# Altium project Carte_Alim.PrjPcb (part 1 of 2)
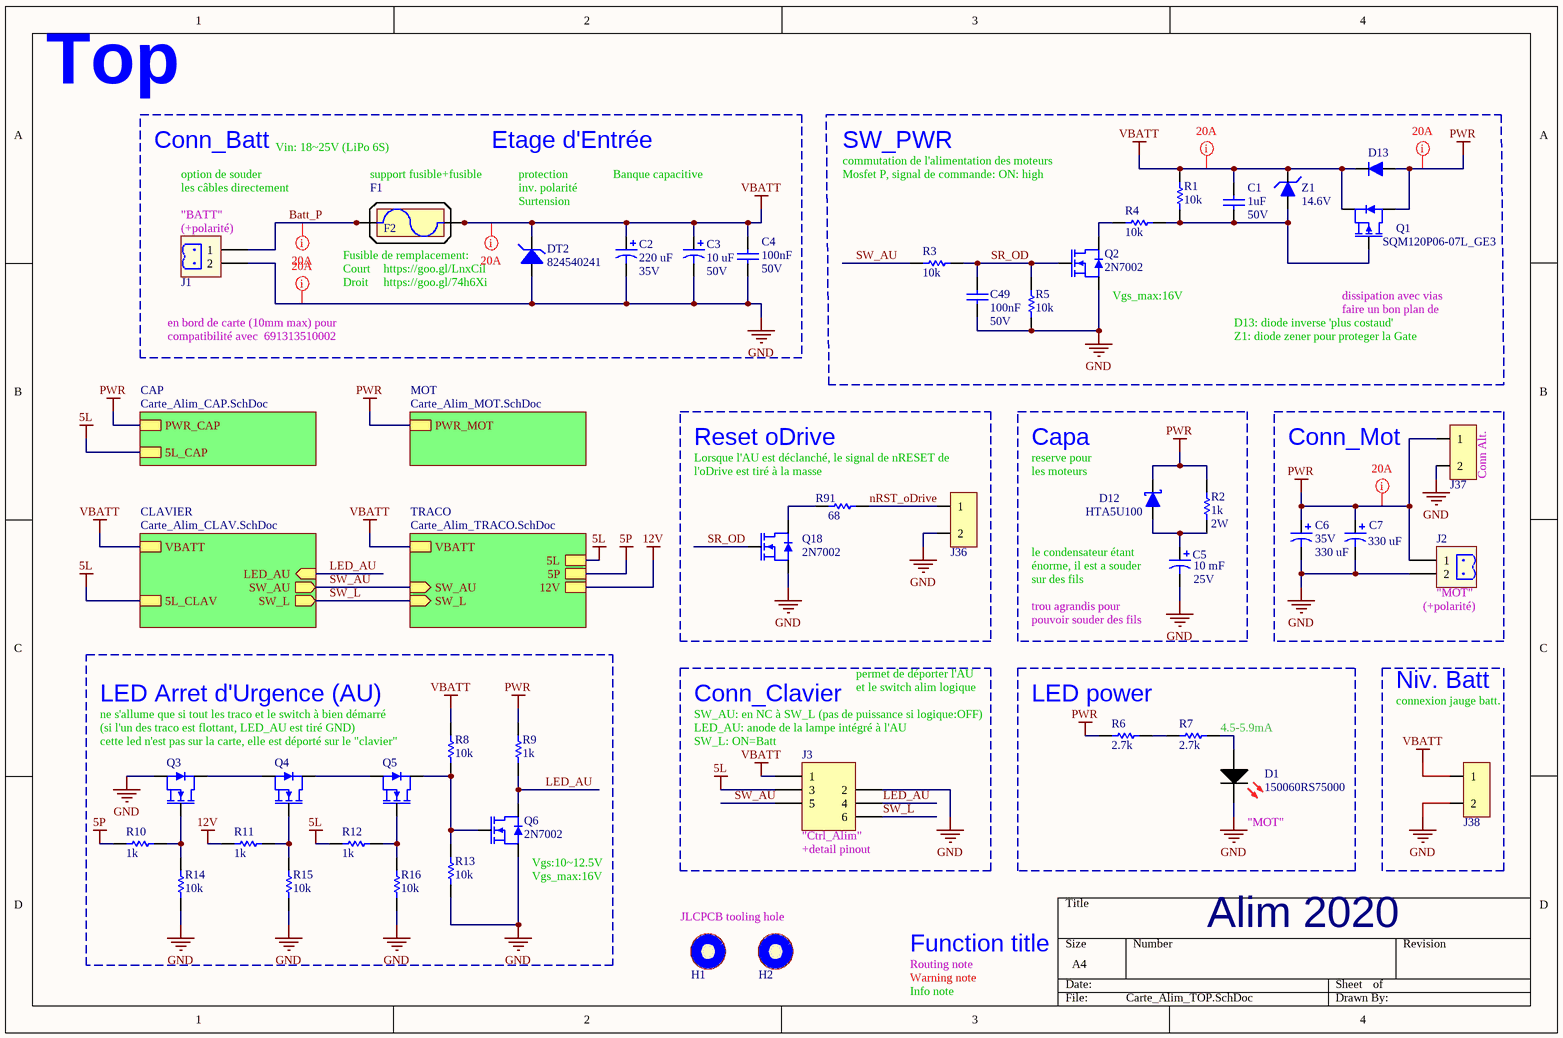
[diagram p0: Carte_Alim_TOP.SchDoc]
5 sheets, 240 parts. Net scope: hierarchical (ports join the sheet entries above them; power ports are global).
Board file: Carte_Alim-4L.PcbDoc
Sheets:
  Carte_Alim_TOP.SchDoc
    CAP = Carte_Alim_CAP.SchDoc
    TRACO = Carte_Alim_TRACO.SchDoc
    MOT = Carte_Alim_MOT.SchDoc
    CLAVIER = Carte_Alim_CLAV.SchDoc

## Sheet Carte_Alim_TOP.SchDoc
size A4; Author: Audran; CompanyName: Goldorak; Address1: Electrolab; Address2: 52 rue Paul Lescop; Address3: 92000 Nanterre; DocumentNumber: 1; SheetNumber: 1; SheetTotal: 5; ProjectName: Cartes_2017

### Parts
C1  1uF  RatedVoltage: 50V  [WCAP-CSGP_0805, 2x1.25x1.25]
C2  220 uF  RatedVoltage: 35V  [WCAP-ATG8_8x11.5x3.5x0.5]
C3  10 uF  RatedVoltage: 50V  [WCAP-ATG8_5x11x2x0.5]
C4  100nF  RatedVoltage: 50V  [WCAP-CSGP_0603, 1.6x0.8x0.8]
C5  10 mF  RatedVoltage: 25V  [WCAP-ATG8_22x41x10x0.8]
C6  330 uF  RatedVoltage: 35V  [WCAP-ATG8_10x12.5x5x0.6]
C7  330 uF  [WCAP-ATG8_10x12.5x5x0.6]
C49  100nF  RatedVoltage: 50V  [WCAP-CSGP_0603, 1.6x0.8x0.8]
D1  150060RS75000  [SMCW_0603]
D12  HTA5U100  [SMA, DO-214AC]
D13  RS3J R6  [SMC, DO-214AB]  (value not drawn)
DT2  824540241  [SMC, DO-214AB]
F1  3557-2  [3557-2]  (value not drawn)
F2  0891030.NXS  (value not drawn)  (mechanical)
H1  1.152mm  [Tooling_hole_JLCPCB]  (value not drawn)  (no BOM)
H2  1.152mm  [Tooling_hole_JLCPCB]  (value not drawn)  (no BOM)
J1  691311500102  [691311500102]  (value not drawn)
J2  691311500102  [691311500102]  (value not drawn)
J3  690367280676  [690367280676]  (value not drawn)
J36  22-03-2021  [22-03-2021]  (value not drawn)
J37  22-03-2021  [22-03-2021]  (value not drawn)
J38  22-03-2021  [22-03-2021]  (value not drawn)
Q1  SQM120P06-07L_GE3  [TO263AB, D2PAK]
Q2  2N7002  [SOT-23]
Q3  2N7002  [SOT-23]  (value not drawn)
Q4  2N7002  [SOT-23]  (value not drawn)
Q5  2N7002  [SOT-23]  (value not drawn)
Q6  2N7002  [SOT-23]
Q18  2N7002  [SOT-23]
R1  value 10k  [RESC1608X06N]  (hidden comment: RC0603FR-0710KL)
R2  1k  Power: 2W  [RESADV480W80L1200D390]
R3  value 10k  [RESC1608X06N]  (hidden comment: RC0603FR-0710KL)
R4  value 10k  [RESC1608X06N]  (hidden comment: RC0603FR-0710KL)
R5  value 10k  [RESC1608X06N]  (hidden comment: RC0603FR-0710KL)
R6  value 2.7k  [RESC2012X06N]  (hidden comment: RC0805FR-072K7L)
R7  value 2.7k  [RESC2012X06N]  (hidden comment: RC0805FR-072K7L)
R8  value 10k  [RESC1608X06N]  (hidden comment: RC0603FR-0710KL)
R9  value 1k  [RESC1608X06N]  (hidden comment: RC0603FR-071KL)
R10  value 1k  [RESC1608X06N]  (hidden comment: RC0603FR-071KL)
R11  value 1k  [RESC1608X06N]  (hidden comment: RC0603FR-071KL)
R12  value 1k  [RESC1608X06N]  (hidden comment: RC0603FR-071KL)
R13  value 10k  [RESC1608X06N]  (hidden comment: RC0603FR-0710KL)
R14  value 10k  [RESC1608X06N]  (hidden comment: RC0603FR-0710KL)
R15  value 10k  [RESC1608X06N]  (hidden comment: RC0603FR-0710KL)
R16  value 10k  [RESC1608X06N]  (hidden comment: RC0603FR-0710KL)
R91  value 68  [RESC1608X06N]  (hidden comment: RC0603FR-0768RL)
Z1  value 14.6V  [SOD-323]  (hidden comment: MM3Z15VST1G)

### Blocks framed on the sheet
SW_PWR: C1 C49 D13 Q1 Q2 R1 R3-R5 Z1
Reset oDrive: J36 Q18 R91
Capa: C5 D12 R2
Conn_Mot: C6 C7 J2 J37
LED Arret d'Urgence (AU): Q3-Q6 R8-R16
Conn_Clavier: J3
LED power: D1 R6 R7
Niv. Batt: J38

### Sub-sheets
CAP = Carte_Alim_CAP.SchDoc: PWR_CAP, 5L_CAP
CLAVIER = Carte_Alim_CLAV.SchDoc: 5L_CLAV, VBATT, SW_L (out), LED_AU (in), SW_AU (out)
MOT = Carte_Alim_MOT.SchDoc: PWR_MOT
TRACO = Carte_Alim_TRACO.SchDoc: VBATT, 5L, 5P, 12V, SW_L (in), SW_AU (in)

### Nets
5L: J3.3 R12.2 ; sheet CAP/5L_CAP, sheet TRACO/5L, sheet CLAVIER/5L_CLAV
5P: R10.2 ; sheet TRACO/5P
12V: R11.2 ; sheet TRACO/12V
GND: C2.2 C3.2 C4.1 C5.2 C6.2 C7.2 C49.1 D1.1(C) DT2.1 J1.2 J2.2 J3.2 J36.2 J37.2 J38.2 Q2.2(S) Q3.2(S) Q6.2(S) Q18.2(S) R5.2 R13.1 R14.1 R15.1 R16.1
PWR: C6.1 C7.1 D12.2 D13.1 J2.1 J37.1 Q1.4(D) R2.1 R6.1 R9.2 ; sheet CAP/PWR_CAP, sheet MOT/PWR_MOT
VBATT: C1.2 C2.1 C3.1 C4.2 D13.2 DT2.2 F1.2 F1.4 J3.1 J38.1 Q1.3(S) R1.2 R8.2 Z1.2 ; sheet TRACO/VBATT, sheet CLAVIER/VBATT
Batt_P: F1.1 F1.3 J1.1
LED_AU: J3.4 Q6.3(D) R9.1 ; sheet CLAVIER/LED_AU
nRST_oDrive: J36.1 R91.2
SR_OD: C49.2 Q2.1(G) Q18.1(G) R3.2 R5.1
SW_AU: J3.5 R3.1 ; sheet TRACO/SW_AU, sheet CLAVIER/SW_AU
SW_L: J3.6 ; sheet TRACO/SW_L, sheet CLAVIER/SW_L
NetC1_1: C1.1 Q1.1(G) R1.1 R4.1 Z1.1
NetC5_1: C5.1 D12.1 R2.2
NetD1_2: D1.2(A) R7.1
NetQ2_3: Q2.3(D) R4.2
NetQ3_1: Q3.1(G) R10.1 R14.2
NetQ3_3: Q3.3(D) Q4.2(S)
NetQ4_1: Q4.1(G) R11.1 R15.2
NetQ4_3: Q4.3(D) Q5.2(S)
NetQ5_1: Q5.1(G) R12.1 R16.2
NetQ5_3: Q5.3(D) Q6.1(G) R8.1 R13.2
NetQ18_3: Q18.3(D) R91.1
NetR6_2: R6.2 R7.2

### Layout directives
net class PWR_20A: Batt_P, GND, PWR, VBATT

### Notes on the sheet
- Top
- Conn_Batt
- option de souder
- Vin: 18~25V (LiPo 6S)
- support fusible+fusible
- Etage d'Entrée
- protection
- Banque capacitive
- commutation de l'alimentation des moteurs
- Mosfet P, signal de commande: ON: high
- les câbles directement
- (near J1) "BATT"
- (near J1) (+polarité)
- inv. polarité
- Surtension
- Droit
- Court
- Fusible de remplacement:
- (near DT2) https://goo.gl/74h6Xi
- (near DT2) https://goo.gl/LnxCil
- (near Q2) Vgs_max:16V
- faire un bon plan de
- dissipation avec vias
- compatibilité avec  691313510002
- en bord de carte (10mm max) pour
- D13: diode inverse 'plus costaud'
- Z1: diode zener pour proteger la Gate
- Lorsque l'AU est déclanché, le signal de nRESET de
- (near R91) l'oDrive est tiré à la masse
- reserve pour
- les moteurs
- (near J37) Conn Alt.
- (near C5) le condensateur étant
- (near C5) énorme, il est a souder
- sur des fils
- (near C5) trou agrandis pour
- (near C5) pouvoir souder des fils
- (near J2) (+polarité)
- (near J2) "MOT"
- (near R8) ne s'allume que si tout les traco et le switch à bien démarré
- SW_AU: en NC à SW_L (pas de puissance si logique:OFF)
- permet de déporter l'AU
- et le switch alim logique
- connexion jauge batt.
- (si l'un des traco est flottant, LED_AU est tiré GND)
- (near R8) cette led n'est pas sur la carte, elle est déporté sur le "clavier"
- (near J3) LED_AU: anode de la lampe intégré à l'AU
- (near J3) SW_L: ON=Batt
- (near R7) 4.5-5.9mA
- (near J3) "Ctrl_Alim"
- (near J3) +detail pinout
- (near D1) "MOT"
- (near Q6) Vgs_max:16V
- (near Q6) Vgs:10~12.5V
- JLCPCB tooling hole
- Routing note
- Warning note
- Function title
- Alim 2020
- Info note

### Library data of the parts
C1 = WCAP-CSGP, 885012207103: CAP CER 1uF 50V X7R 0805; Manufacturer: Wurth Elektronik; ComponentLink1Description: Datasheet; ComponentLink1URL: http://katalog.we-online.com/pbs/datasheet/885012207103.pdf; Manufacturer Part Number: 885012207103; Value: 1uF; Size: 0805; CeramicType: X7R; Supplier 2: JLCPCB; Supplier Part Number 2: C28323; Supplier Footprint 2: 0805
C2 = WCAP-ATG8, 860010574011: CAP Alu 220 UF 20% 35 V; Manufacturer: Wurth Elektronik; ComponentLink1Description: Datasheet; ComponentLink1URL: http://katalog.we-online.de/pbs/datasheet/860010574011.pdf; Manufacturer Part Number: 860010574011; Value: 220 uF; Size: 8mmx11.5mm
C3 = WCAP-ATG8, 860010672009: CAP Alu 10 UF 20% 50 V; Manufacturer: Wurth Elektronik; ComponentLink1Description: Datasheet; ComponentLink1URL: http://katalog.we-online.de/pbs/datasheet/860010672009.pdf; Value: 10 uF; Size: 5mmx11mm; Manufacturer Part Number: 860010672009
C4 C49 = WCAP-CSGP, 885012206095: CAP CER 100nF 50V X7R 0603; Manufacturer: Wurth Elektronik; ComponentLink1Description: Datasheet; ComponentLink1URL: http://katalog.we-online.com/pbs/datasheet/885012206095.pdf; Value: 100nF; Size: 0603; CeramicType: X7R; Manufacturer Part Number: 885012206095; Supplier 2: JLCPCB; Supplier Part Number 2: C14663; Supplier Footprint 2: 0603
C5 = WCAP-ATG8, 860010483029: CAP Alu 10'000 UF 25 V; Manufacturer: Wurth Elektronik; ComponentLink1Description: Datasheet; ComponentLink1URL: http://katalog.we-online.de/pbs/datasheet/860010483029.pdf; Manufacturer Part Number: 860010483029; Size: 22x41mm; Value: 10 mF
C6 = WCAP-ATG8, 860010575012: CAP Alu 330 UF 20% 35 V; Manufacturer: Wurth Elektronik; ComponentLink1Description: Datasheet; ComponentLink1URL: http://katalog.we-online.de/pbs/datasheet/860010575012.pdf; Manufacturer Part Number: 860010575012; Value: 330 uF; Size: 10mmx12.5mm
C7 = WCAP-ATG8, 860010575012: CAP Alu 330 UF 20% 35 V; Manufacturer: Wurth Elektronik; RatedVoltage: 35V; ComponentLink1Description: Datasheet; ComponentLink1URL: http://katalog.we-online.de/pbs/datasheet/860010575012.pdf; Manufacturer Part Number: 860010575012; Value: 330 uF; Size: 10mmx12.5mm
D1 = WL-SMCW 0603  150060RS75000: SMD mono-color Chip LED, WL-SMCW, Red; Manufacturer: Wurth Elektronik; Value: Rouge; Manufacturer Part Number: 150060RS75000; ComponentLink1Description: Datasheet; ComponentLink1URL: http://katalog.we-online.com/led/datasheet/150060RS75000.pdf; Supplier 1: Farnell; Supplier Part Number 1: 2322071; Supplier 2: JLCPCB; Supplier Part Number 2: C2286; Supplier Footprint 2: LED_0603
D12 = HTA5U100: DIODE SCHOTTKY 100V 5A SMA (DO-214AC); Manufacturer: MULTICOMP; ContinuousForwardCurrent: 5A (Pk 50A); Supplier 1: Farnell; Manufacturer Part Number: HTA5U100; ComponentLink1URL: http://www.farnell.com/datasheets/2282884.pdf; ComponentLink1Description: Datasheet; Supplier Part Number 1: 2750942; Type: Schottky; Value: 100V
D13 = RS3J_R6: DIODE GEN PURP 600V 3A SMC; Manufacturer: TAIWAN SEMICONDUCTOR; Type: Standard; Manufacturer Part Number: RS3J R6; ContinuousForwardCurrent: 3A; Supplier 1: Farnell; Supplier Part Number 1: 2677388; ComponentLink1Description: Datasheet; ComponentLink1URL: http://www.farnell.com/datasheets/2182655.pdf; Value: 600V
DT2 = 824540241: WE-TVSP Power TVS Diode, Unidirectional, 1500 W, 24 VDC; Manufacturer: Wurth Electronics Inc.; Value: 24V; Supplier 1: Farnell; Supplier Part Number 1: 2536699; Manufacturer Part Number: 824540241; ComponentLink1URL: https://www.we-online.com/catalog/datasheet/824540241.pdf; ComponentLink1Description: Datasheet; Type: TVS
F1 = 3557-2: FUSE Holder 500V 30A PCB; Manufacturer: Keystone Electronics; Value: na; Supplier 1: Farnell; Supplier Part Number 1: 2292904; Manufacturer Part Number: 3557-2; ComponentLink1URL: http://www.keyelco.com/product-pdf.cfm?p=296; ComponentLink1Description: Datasheet
F2 = 0891030.NXS: FUSE AUTO 30A 58VDC BLADE MINI; Manufacturer: Littelfuse Inc.; Manufacturer Part Number: 0891030.NXS; Supplier 1: Digi-Key; Supplier Part Number 1: F4993-ND; ComponentLink1URL: http://www.littelfuse.com/~/media/automotive/datasheets/fuses/passenger-car-and-commercial-vehicle/blade-fuses/littelfuse_lowprofilemini_datasheet.pdf; ComponentLink1Description: Datasheet; Value: 30A
H1 H2 = HOLE_TOOLING: Tooling hole pour JLCPCB assembly; ComponentLink1Description: Manufacturer; ComponentLink1URL: https://support.jlcpcb.com/article/92-how-to-add-tooling-holes-for-smt-assembly-order
J1 J2 = 691311500102: WR-TBL 2p Series 311 - 5.08 mm Closed Vertical PCB Header; Manufacturer: Wurth Electronics Inc.; Value: 2; Manufacturer Part Number: 691311500102; ComponentLink1Description: Datasheet; ComponentLink1URL: https://katalog.we-online.de/em/datasheet/6913115001xx.pdf; Supplier 1: Farnell; Supplier Part Number 1: 1641978
J3 = 690367280676: WR-MM 6p Female SMT Connector with Polarization; Manufacturer: Wurth Electronics Inc.; Value: 6; ComponentLink1Description: Datasheet; ComponentLink1URL: http://katalog.we-online.de/em/datasheet/69036728xx76.pdf; Manufacturer Part Number: 690367280676; Supplier 1: Farnell; Supplier Part Number 1: 1641849
J36-J38 = 22-03-2021: CONN HEADER VERT 2POS 2.54MM; Manufacturer: MOLEX; Supplier 1: Farnell; Supplier Part Number 1: 9731075; Manufacturer Part Number: 22-03-2021; ComponentLink1URL: http://www.farnell.com/datasheets/1791308.pdf; ComponentLink1Description: Datasheet; ComponentLink2URL: http://www.farnell.com/cad/495071.pdf  http://www.farnell.com/cad/1533907.pdf  http://www.farnell.com/cad/1533907.pdf; ComponentLink2Description: Drawings
Q1 = SQM120P06-07L_GE3: MOSFET P 60V 120A D2PAK; Manufacturer: VISHAY; Supplier 1: Farnell; Supplier Part Number 1: 2617099; Manufacturer Part Number: SQM120P06-07L_GE3; ComponentLink1Description: Datasheet; ComponentLink1URL: http://www.vishay.com/docs/67026/sqm120p0.pdf
Q2-Q6 Q18 = 2N7002: MOSFET N 60V 115MA SOT23; Manufacturer: Changjiang Electronics Tech (CJ); Supplier 1: Farnell; Supplier Part Number 1: 1510761; Manufacturer Part Number: 2N7002; ComponentLink1Description: Datasheet; ComponentLink1URL: https://datasheet.lcsc.com/szlcsc/1810151612_Changjiang-Electronics-Tech-CJ-2N7002_C8545.pdf; Supplier 2: JLCPCB; Supplier Part Number 2: C8545; Supplier Footprint 2: SOT-23-3
R1 R3-R5 R8 R13-R16 = RC0603FR-0710KL: RES SMD 10K OHM 1% 1/10W 0603; Manufacturer: Yageo; Power: 100mW; Vmax: 50V; Manufacturer Part Number: RC0603FR-0710KL; Type: Thick Film; ComponentLink1Description: Manufacturer; ComponentLink1URL: http://www.yageo.com/NewPortal/_en/index.jsp; ComponentLink2Description: Datasheet; ComponentLink2URL: http://www.farnell.com/datasheets/2167052.pdf; Supplier 1: Farnell; Supplier Part Number 1: 9238603; Precision: ±1%; Supplier 2: JLCPCB; Supplier Part Number 2: C25804; Supplier Footprint 2: 0603
R2 = Generic_TH_Vert_Res: resistance traversante verticale générique; Manufacturer: MULTICOMP; Manufacturer Part Number: MCKNP02WJ0102A19; Precision: ±5%; Type: Through Hole; Supplier 1: Farnell; Supplier Part Number 1: 1903754; Value: 1k
R6 R7 = RC0805FR-072K7L: RES SMD 2K7 OHM 1% 1/8W 0805; Manufacturer: Yageo; Power: 125mW; Vmax: 50V; Manufacturer Part Number: RC0805FR-072K7L; Type: Thick Film; ComponentLink1Description: Manufacturer; ComponentLink1URL: http://www.yageo.com/NewPortal/_en/index.jsp; ComponentLink2Description: Datasheet; ComponentLink2URL: http://www.farnell.com/datasheets/444164.pdf; Supplier 1: Farnell; Supplier Part Number 1: 9237666; Precision: ±1%; Supplier 2: JLCPCB; Supplier Part Number 2: C17530; Supplier Footprint 2: 0805
R9-R12 = RC0603FR-071KL: RES SMD 1K OHM 1% 1/10W 0603; Manufacturer: Yageo; Power: 100mW; Vmax: 50V; Manufacturer Part Number: RC0603FR-071KL; Type: Thick Film; ComponentLink1Description: Manufacturer; ComponentLink1URL: http://www.yageo.com/NewPortal/_en/index.jsp; ComponentLink2Description: Datasheet; ComponentLink2URL: http://www.farnell.com/datasheets/2167052.pdf; Precision: ±1%; Supplier 1: Farnell; Supplier Part Number 1: 9238484; Supplier 2: JLCPCB; Supplier Part Number 2: C21190; Supplier Footprint 2: 0603
R91 = RC0603FR-0768RL: RES SMD 68 OHM 1% 1/10W 0603; Manufacturer: Yageo; Power: 100mW; Vmax: 50V; Manufacturer Part Number: RC0603FR-0768RL; Type: Thick Film; ComponentLink1Description: Manufacturer; ComponentLink1URL: http://www.yageo.com/NewPortal/_en/index.jsp; ComponentLink2Description: Datasheet; ComponentLink2URL: http://www.farnell.com/datasheets/1868787.pdf; Supplier 1: Farnell; Supplier Part Number 1: 9238344; Precision: ±1%; Supplier 2: JLCPCB; Supplier Part Number 2: C27592; Supplier Footprint 2: 0603
Z1 = MM3Z15VST1G: DIODE ZENER 14.6V 300mW SOD323; Manufacturer: ON Semiconductor; Manufacturer Part Number: MM3Z15VST1G; ComponentLink1URL: http://www.farnell.com/datasheets/2028649.pdf; ComponentLink1Description: Datasheet; Supplier 1: Farnell; Supplier Part Number 1: 2533369; Type: Zener

## Sheet Carte_Alim_CAP.SchDoc
size A4; Author: Audran; CompanyName: Goldorak; Address1: Electrolab; Address2: 52 rue Paul Lescop; Address3: 92000 Nanterre; DocumentNumber: 4; SheetNumber: 4; SheetTotal: 5; ProjectName: Cartes_2017
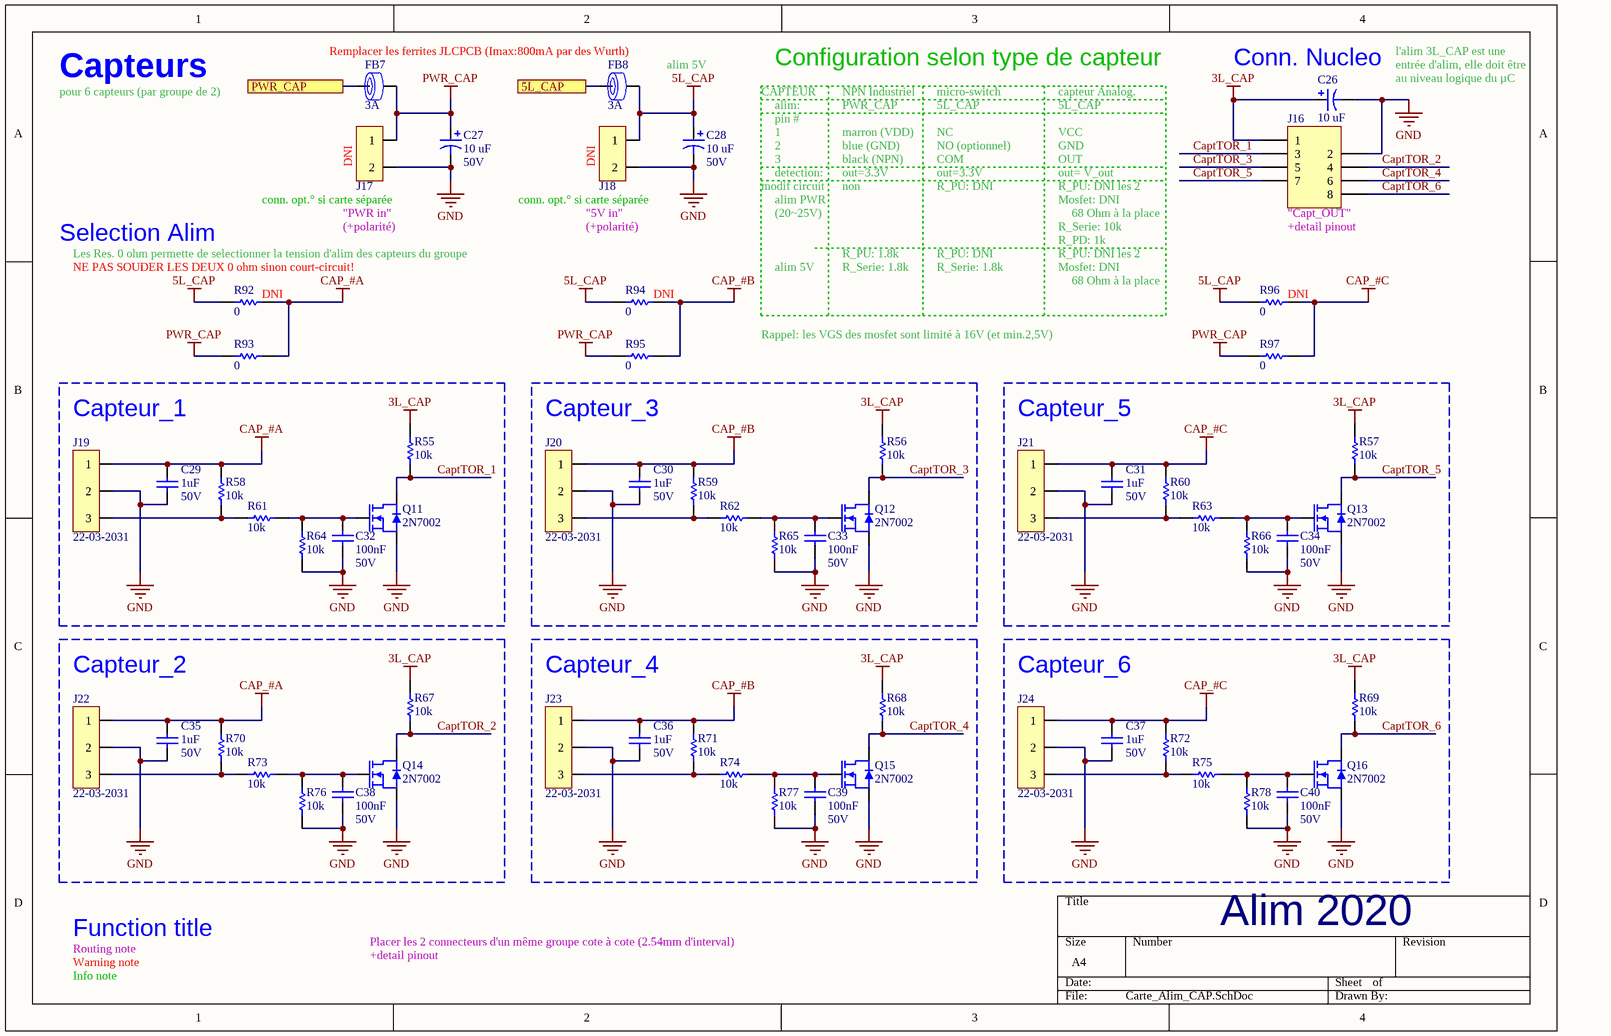
[diagram p1: Carte_Alim_CAP.SchDoc]

### Parts
C26  10 uF  [WCAP-ATG8_5x11x2x0.5]
C27  10 uF  RatedVoltage: 50V  [WCAP-ATG8_5x11x2x0.5]
C28  10 uF  RatedVoltage: 50V  [WCAP-ATG8_5x11x2x0.5]
C29  1uF  RatedVoltage: 50V  [WCAP-CSGP_0805, 2x1.25x1.25]
C30  1uF  RatedVoltage: 50V  [WCAP-CSGP_0805, 2x1.25x1.25]
C31  1uF  RatedVoltage: 50V  [WCAP-CSGP_0805, 2x1.25x1.25]
C32  100nF  RatedVoltage: 50V  [WCAP-CSGP_0603, 1.6x0.8x0.8]
C33  100nF  RatedVoltage: 50V  [WCAP-CSGP_0603, 1.6x0.8x0.8]
C34  100nF  RatedVoltage: 50V  [WCAP-CSGP_0603, 1.6x0.8x0.8]
C35  1uF  RatedVoltage: 50V  [WCAP-CSGP_0805, 2x1.25x1.25]
C36  1uF  RatedVoltage: 50V  [WCAP-CSGP_0805, 2x1.25x1.25]
C37  1uF  RatedVoltage: 50V  [WCAP-CSGP_0805, 2x1.25x1.25]
C38  100nF  RatedVoltage: 50V  [WCAP-CSGP_0603, 1.6x0.8x0.8]
C39  100nF  RatedVoltage: 50V  [WCAP-CSGP_0603, 1.6x0.8x0.8]
C40  100nF  RatedVoltage: 50V  [WCAP-CSGP_0603, 1.6x0.8x0.8]
FB7  RatedCurrent: 3A  [WE-CBF_0805_High Current]  (hidden comment: 742792023)
FB8  RatedCurrent: 3A  [WE-CBF_0805_High Current]  (hidden comment: 742792023)
J16  690367280876  [690367280876]  (value not drawn)
J17  22-03-2021  [22-03-2021]  (value not drawn)
J18  22-03-2021  [22-03-2021]  (value not drawn)
J19  22-03-2031  [22-03-2031]
J20  22-03-2031  [22-03-2031]
J21  22-03-2031  [22-03-2031]
J22  22-03-2031  [22-03-2031]
J23  22-03-2031  [22-03-2031]
J24  22-03-2031  [22-03-2031]
Q11  2N7002  [SOT-23]
Q12  2N7002  [SOT-23]
Q13  2N7002  [SOT-23]
Q14  2N7002  [SOT-23]
Q15  2N7002  [SOT-23]
Q16  2N7002  [SOT-23]
R55  value 10k  [RESC1608X06N]  (hidden comment: RC0603FR-0710KL)
R56  value 10k  [RESC1608X06N]  (hidden comment: RC0603FR-0710KL)
R57  value 10k  [RESC1608X06N]  (hidden comment: RC0603FR-0710KL)
R58  value 10k  [RESC1608X06N]  (hidden comment: RC0603FR-0710KL)
R59  value 10k  [RESC1608X06N]  (hidden comment: RC0603FR-0710KL)
R60  value 10k  [RESC1608X06N]  (hidden comment: RC0603FR-0710KL)
R61  value 10k  [RESC1608X06N]  (hidden comment: RC0603FR-0710KL)
R62  value 10k  [RESC1608X06N]  (hidden comment: RC0603FR-0710KL)
R63  value 10k  [RESC1608X06N]  (hidden comment: RC0603FR-0710KL)
R64  value 10k  [RESC1608X06N]  (hidden comment: RC0603FR-0710KL)
R65  value 10k  [RESC1608X06N]  (hidden comment: RC0603FR-0710KL)
R66  value 10k  [RESC1608X06N]  (hidden comment: RC0603FR-0710KL)
R67  value 10k  [RESC1608X06N]  (hidden comment: RC0603FR-0710KL)
R68  value 10k  [RESC1608X06N]  (hidden comment: RC0603FR-0710KL)
R69  value 10k  [RESC1608X06N]  (hidden comment: RC0603FR-0710KL)
R70  value 10k  [RESC1608X06N]  (hidden comment: RC0603FR-0710KL)
R71  value 10k  [RESC1608X06N]  (hidden comment: RC0603FR-0710KL)
R72  value 10k  [RESC1608X06N]  (hidden comment: RC0603FR-0710KL)
R73  value 10k  [RESC1608X06N]  (hidden comment: RC0603FR-0710KL)
R74  value 10k  [RESC1608X06N]  (hidden comment: RC0603FR-0710KL)
R75  value 10k  [RESC1608X06N]  (hidden comment: RC0603FR-0710KL)
R76  value 10k  [RESC1608X06N]  (hidden comment: RC0603FR-0710KL)
R77  value 10k  [RESC1608X06N]  (hidden comment: RC0603FR-0710KL)
R78  value 10k  [RESC1608X06N]  (hidden comment: RC0603FR-0710KL)
R92  value 0  [RESC1608X06N]  (hidden comment: RC0603FR-070RL)
R93  value 0  [RESC1608X06N]  (hidden comment: RC0603FR-070RL)
R94  value 0  [RESC1608X06N]  (hidden comment: RC0603FR-070RL)
R95  value 0  [RESC1608X06N]  (hidden comment: RC0603FR-070RL)
R96  value 0  [RESC1608X06N]  (hidden comment: RC0603FR-070RL)
R97  value 0  [RESC1608X06N]  (hidden comment: RC0603FR-070RL)

### Blocks framed on the sheet
Capteur_1: C29 C32 J19 Q11 R55 R58 R61 R64
Capteur_3: C30 C33 J20 Q12 R56 R59 R62 R65
Capteur_5: C31 C34 J21 Q13 R57 R60 R63 R66
Capteur_2: C35 C38 J22 Q14 R67 R70 R73 R76
Capteur_4: C36 C39 J23 Q15 R68 R71 R74 R77
Capteur_6: C37 C40 J24 Q16 R69 R72 R75 R78

### Ports
5L_CAP, PWR_CAP

### Nets
3L_CAP: C26.1 J16.1 R55.2 R56.2 R57.2 R67.2 R68.2 R69.2
5L: FB8.1 ; port 5L_CAP
5L_CAP: C28.1 FB8.2 J18.1 R92.1 R94.1 R96.1
CAP_#A: C29.2 C35.2 J19.1 J22.1 R58.2 R70.2 R92.2 R93.2
CAP_#B: C30.2 C36.2 J20.1 J23.1 R59.2 R71.2 R94.2 R95.2
CAP_#C: C31.2 C37.2 J21.1 J24.1 R60.2 R72.2 R96.2 R97.2
GND: C26.2 C27.2 C28.2 C29.1 C30.1 C31.1 C32.2 C33.2 C34.2 C35.1 C36.1 C37.1 C38.2 C39.2 C40.2 J16.2 J17.2 J18.2 J19.2 J20.2 J21.2 J22.2 J23.2 J24.2 Q11.2(S) Q12.2(S) Q13.2(S) Q14.2(S) Q15.2(S) Q16.2(S) R64.1 R65.1 R66.1 R76.1 R77.1 R78.1
PWR: FB7.1 ; port PWR_CAP
PWR_CAP: C27.1 FB7.2 J17.1 R93.1 R95.1 R97.1
CaptTOR_1: J16.3 Q11.3(D) R55.1
CaptTOR_2: J16.4 Q14.3(D) R67.1
CaptTOR_3: J16.5 Q12.3(D) R56.1
CaptTOR_4: J16.6 Q15.3(D) R68.1
CaptTOR_5: J16.7 Q13.3(D) R57.1
CaptTOR_6: J16.8 Q16.3(D) R69.1
NetC32_1: C32.1 Q11.1(G) R61.2 R64.2
NetC33_1: C33.1 Q12.1(G) R62.2 R65.2
NetC34_1: C34.1 Q13.1(G) R63.2 R66.2
NetC38_1: C38.1 Q14.1(G) R73.2 R76.2
NetC39_1: C39.1 Q15.1(G) R74.2 R77.2
NetC40_1: C40.1 Q16.1(G) R75.2 R78.2
NetJ19_3: J19.3 R58.1 R61.1
NetJ20_3: J20.3 R59.1 R62.1
NetJ21_3: J21.3 R60.1 R63.1
NetJ22_3: J22.3 R70.1 R73.1
NetJ23_3: J23.3 R71.1 R74.1
NetJ24_3: J24.3 R72.1 R75.1

### Notes on the sheet
- Capteurs
- pour 6 capteurs (par groupe de 2)
- Remplacer les ferrites JLCPCB (Imax:800mA par des Wurth)
- alim 5V
- CAPTEUR
- alim:
- Configuration selon type de capteur
- NPN Industriel
- PWR_CAP
- micro-switch
- 5L_CAP
- capteur Analog.
- (near C26) Conn. Nucleo
- l'alim 3L_CAP est une
- au niveau logique du µC
- entrée d'alim, elle doit être
- (near J17) DNI
- (near J18) DNI
- pin #
- 1
- 2
- 3
- detection:
- marron (VDD)
- blue (GND)
- black (NPN)
- out=3.3V
- NC
- NO (optionnel)
- COM
- VCC
- OUT
- GND
- out= V_out
- Selection Alim
- (near J17) conn. opt.° si carte séparée
- (near J17) "PWR in"
- (+polarité)
- conn. opt.° si carte séparée
- (near J18) "5V in"
- modif circuit
- alim PWR
- (20~25V)
- non
- R_PU: DNI
- R_PU: DNI les 2
- Mosfet: DNI
- R_Serie: 10k
- R_PD: 1k
- 68 Ohm à la place
- (near J16) "Capt_OUT"
- (near J16) +detail pinout
- (near R92) Les Res. 0 ohm permette de selectionner la tension d'alim des capteurs du groupe
- (near R92) NE PAS SOUDER LES DEUX 0 ohm sinon court-circuit!
- (near R92) DNI
- (near R94) DNI
- R_PU: 1.8k
- R_Serie: 1.8k
- (near R96) DNI
- Rappel: les VGS des mosfet sont limité à 16V (et min.2,5V)
- Routing note
- Warning note
- Info note
- Function title
- Placer les 2 connecteurs d'un même groupe cote à cote (2.54mm d'interval)
- +detail pinout
- Alim 2020

### Library data of the parts
C26 = WCAP-ATG8, 860010672009: CAP Alu 10 UF 20% 50 V; Manufacturer: Wurth Elektronik; RatedVoltage: 50V; ComponentLink1Description: Datasheet; ComponentLink1URL: http://katalog.we-online.de/pbs/datasheet/860010672009.pdf; Value: 10 uF; Size: 5mmx11mm; Manufacturer Part Number: 860010672009
C27 C28 = WCAP-ATG8, 860010672009: as C3 on sheet Carte_Alim_TOP; ComponentLink1Description: Datasheet; ComponentLink1URL: http://katalog.we-online.de/pbs/datasheet/860010672009.pdf; Value: 10 uF; Size: 5mmx11mm; Manufacturer Part Number: 860010672009
C29-C31 C35-C37 = WCAP-CSGP, 885012207103: as C1 on sheet Carte_Alim_TOP; ComponentLink1Description: Datasheet; ComponentLink1URL: http://katalog.we-online.com/pbs/datasheet/885012207103.pdf; Manufacturer Part Number: 885012207103; Value: 1uF; Size: 0805; CeramicType: X7R; Supplier 2: JLCPCB; Supplier Part Number 2: C28323; Supplier Footprint 2: 0805
C32-C34 C38-C40 = WCAP-CSGP, 885012206095: as C4 on sheet Carte_Alim_TOP; ComponentLink1Description: Datasheet; ComponentLink1URL: http://katalog.we-online.com/pbs/datasheet/885012206095.pdf; Value: 100nF; Size: 0603; CeramicType: X7R; Manufacturer Part Number: 885012206095; Supplier 2: JLCPCB; Supplier Part Number 2: C14663; Supplier Footprint 2: 0603
FB7 FB8 = WE-CBF, 742792023: Ferrite Bead 120ohm 0805 3A; Manufacturer: Wurth Elektronik; Value: 120Ω; ComponentLink1Description: Manufacturer; ComponentLink1URL: https://www.we-online.com/catalog/en/WE-CBF/?sq=742792023#742792023; ComponentLink2Description: Datasheet; ComponentLink2URL: https://www.we-online.com/catalog/datasheet/742792023.pdf; Manufacturer Part Number: 742792023; Supplier 2: JLCPCB; Supplier Part Number 2: C1015; Supplier 1: Farnell; Supplier Part Number 1: 1635732; Supplier Footprint 2: 0805
J16 = 690367280876: WR-MM 8p Female SMT Connector with Polarization; Manufacturer: Wurth Electronics Inc.; Value: 8; Manufacturer Part Number: 690367280876; ComponentLink1Description: Datasheet; ComponentLink1URL: http://katalog.we-online.de/em/datasheet/69036728xx76.pdf; Supplier 1: Farnell; Supplier Part Number 1: 1641850
J17 J18 = 22-03-2021: as J36 on sheet Carte_Alim_TOP; Supplier 1: Farnell; Supplier Part Number 1: 9731075; Manufacturer Part Number: 22-03-2021; ComponentLink1URL: http://www.farnell.com/datasheets/1791308.pdf; ComponentLink1Description: Datasheet; ComponentLink2URL: http://www.farnell.com/cad/495071.pdf  http://www.farnell.com/cad/1533907.pdf  http://www.farnell.com/cad/1533907.pdf; ComponentLink2Description: Drawings
J19-J24 = 22-03-2031: CONN HEADER VERT 3POS 2.54MM; Manufacturer: MOLEX; Supplier 1: Farnell; Supplier Part Number 1: 9731083; Manufacturer Part Number: 22-03-2031; ComponentLink1URL: http://www.farnell.com/datasheets/1785732.pdf; ComponentLink1Description: Datasheet; ComponentLink2URL: http://www.farnell.com/cad/495071.pdf  http://www.farnell.com/cad/1533907.pdf  http://www.farnell.com/cad/1533907.pdf; ComponentLink2Description: Drawings
Q11-Q16 = 2N7002: as Q2 on sheet Carte_Alim_TOP; Supplier 1: Farnell; Supplier Part Number 1: 1510761; Manufacturer Part Number: 2N7002; ComponentLink1Description: Datasheet; ComponentLink1URL: https://datasheet.lcsc.com/szlcsc/1810151612_Changjiang-Electronics-Tech-CJ-2N7002_C8545.pdf; Supplier 2: JLCPCB; Supplier Part Number 2: C8545; Supplier Footprint 2: SOT-23-3
R55-R78 = RC0603FR-0710KL: as R1 on sheet Carte_Alim_TOP; Manufacturer Part Number: RC0603FR-0710KL; Type: Thick Film; ComponentLink1Description: Manufacturer; ComponentLink1URL: http://www.yageo.com/NewPortal/_en/index.jsp; ComponentLink2Description: Datasheet; ComponentLink2URL: http://www.farnell.com/datasheets/2167052.pdf; Supplier 1: Farnell; Supplier Part Number 1: 9238603; Precision: ±1%; Supplier 2: JLCPCB; Supplier Part Number 2: C25804; Supplier Footprint 2: 0603
R92-R97 = RC0603FR-070RL: RES SMD 0 OHM 1% 1/10W 0603; Manufacturer: Yageo; Power: 100mW; Vmax: 50V; Manufacturer Part Number: RC0603FR-070RL; Type: Thick Film; ComponentLink1Description: Manufacturer; ComponentLink1URL: http://www.yageo.com/NewPortal/_en/index.jsp; ComponentLink2Description: Datasheet; ComponentLink2URL: http://www.farnell.com/datasheets/2167052.pdf; Supplier 1: Farnell; Precision: ±1%; Supplier Part Number 1: 2309106; Supplier 2: JLCPCB; Supplier Part Number 2: C21189; Supplier Footprint 2: 0603

## Sheet Carte_Alim_TRACO.SchDoc
size A4; Author: Audran; CompanyName: Goldorak; Address1: Electrolab; Address2: 52 rue Paul Lescop; Address3: 92000 Nanterre; DocumentNumber: 2; SheetNumber: 2; SheetTotal: 5; ProjectName: Cartes_2017
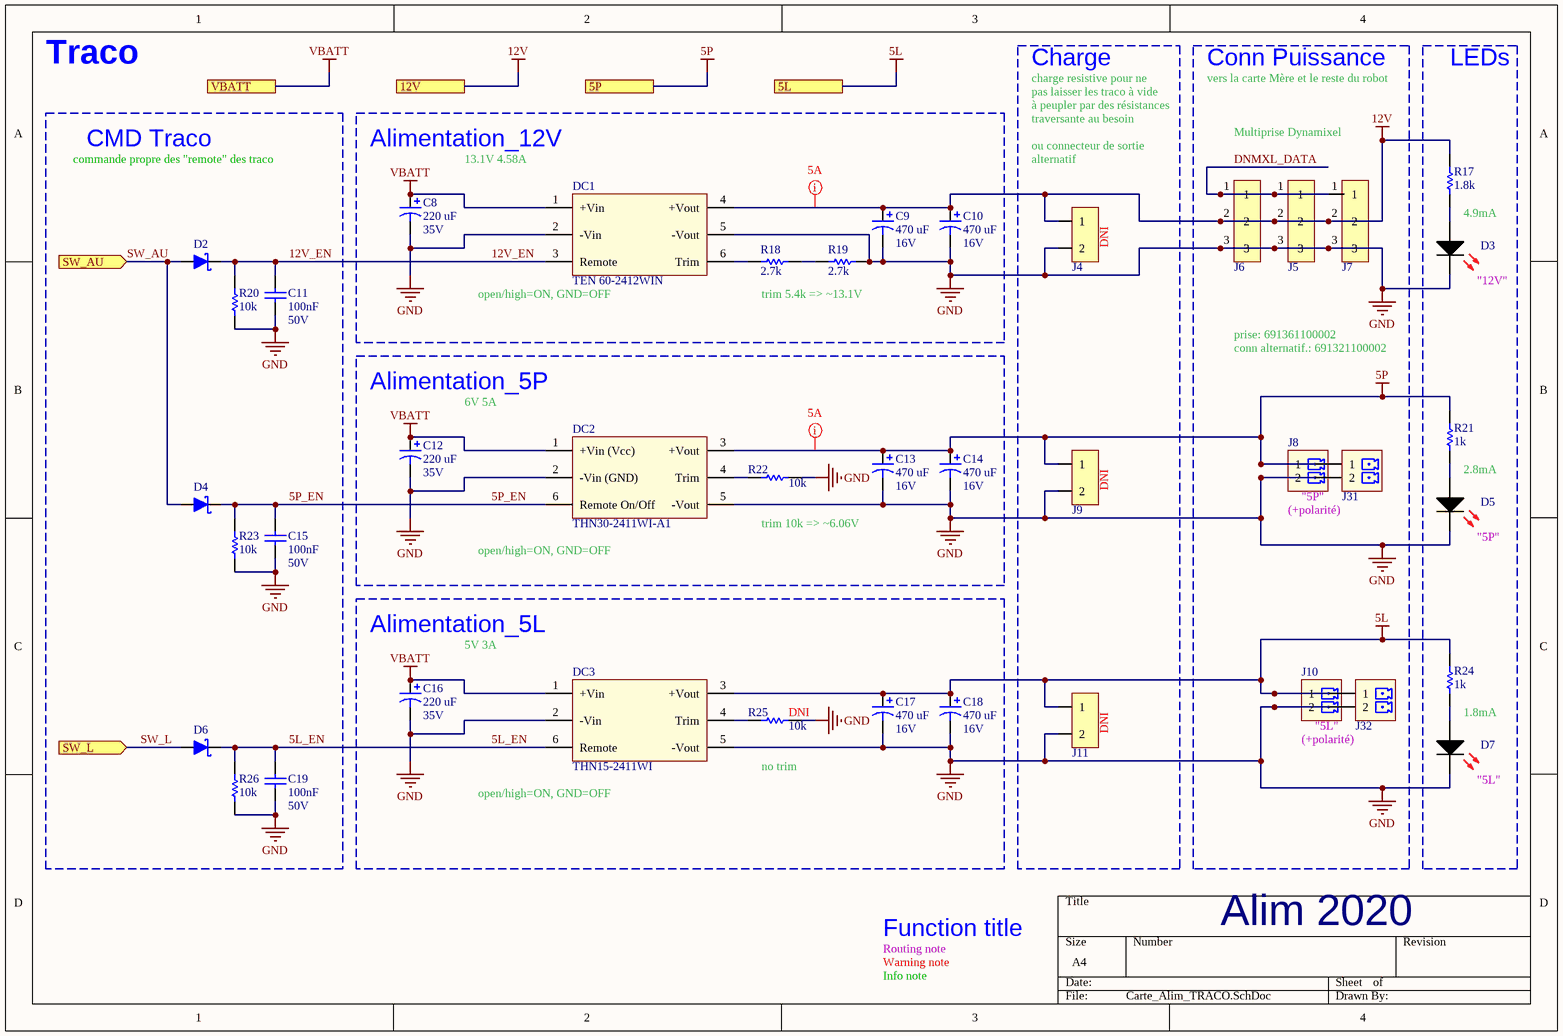
[diagram p2: Carte_Alim_TRACO.SchDoc]

### Parts
C8  220 uF  RatedVoltage: 35V  [WCAP-ATG8_8x11.5x3.5x0.5]
C9  470 uF  RatedVoltage: 16V  [WCAP-ATG8_8x11.5x3.5x0.5]
C10  470 uF  RatedVoltage: 16V  [WCAP-ATG8_8x11.5x3.5x0.5]
C11  100nF  RatedVoltage: 50V  [WCAP-CSGP_0603, 1.6x0.8x0.8]
C12  220 uF  RatedVoltage: 35V  [WCAP-ATG8_8x11.5x3.5x0.5]
C13  470 uF  RatedVoltage: 16V  [WCAP-ATG8_8x11.5x3.5x0.5]
C14  470 uF  RatedVoltage: 16V  [WCAP-ATG8_8x11.5x3.5x0.5]
C15  100nF  RatedVoltage: 50V  [WCAP-CSGP_0603, 1.6x0.8x0.8]
C16  220 uF  RatedVoltage: 35V  [WCAP-ATG8_8x11.5x3.5x0.5]
C17  470 uF  RatedVoltage: 16V  [WCAP-ATG8_8x11.5x3.5x0.5]
C18  470 uF  RatedVoltage: 16V  [WCAP-ATG8_8x11.5x3.5x0.5]
C19  100nF  RatedVoltage: 50V  [WCAP-CSGP_0603, 1.6x0.8x0.8]
D2  RBR3MM40ATFTR  [SOD-123FL]  (value not drawn)
D3  150060RS75000  [SMCW_0603]  (value not drawn)
D4  RBR3MM40ATFTR  [SOD-123FL]  (value not drawn)
D5  150060RS75000  [SMCW_0603]  (value not drawn)
D6  RBR3MM40ATFTR  [SOD-123FL]  (value not drawn)
D7  150060RS75000  [SMCW_0603]  (value not drawn)
DC1  TEN 60-2412WIN  [TEN 60]
DC2  THN30-2411WI-A1  [THN 30WI-A1]
DC3  THN15-2411WI  [THN 15WI]
J4  22-03-2021  [22-03-2021]  (value not drawn)
J5  22-03-5035  [20-03-5035]  (value not drawn)
J6  22-03-5035  [20-03-5035]  (value not drawn)
J7  22-03-5035  [20-03-5035]  (value not drawn)
J8  691322110002  [691322110002]  (value not drawn)
J9  22-03-2021  [22-03-2021]  (value not drawn)
J10  691322110002  [691322110002]  (value not drawn)
J11  22-03-2021  [22-03-2021]  (value not drawn)
J31  691321100002  [691321100002]  (value not drawn)
J32  691321100002  [691321100002]  (value not drawn)
R17  value 1.8k  [RESC1608X06N]  (hidden comment: RC0603FR-071K8L)
R18  value 2.7k  [RESC2012X06N]  (hidden comment: RC0805FR-072K7L)
R19  value 2.7k  [RESC2012X06N]  (hidden comment: RC0805FR-072K7L)
R20  value 10k  [RESC1608X06N]  (hidden comment: RC0603FR-0710KL)
R21  value 1k  [RESC1608X06N]  (hidden comment: RC0603FR-071KL)
R22  value 10k  [RESC1608X06N]  (hidden comment: RC0603FR-0710KL)
R23  value 10k  [RESC1608X06N]  (hidden comment: RC0603FR-0710KL)
R24  value 1k  [RESC1608X06N]  (hidden comment: RC0603FR-071KL)
R25  value 10k  [RESC1608X06N]  (hidden comment: RC0603FR-0710KL)
R26  value 10k  [RESC1608X06N]  (hidden comment: RC0603FR-0710KL)

### Blocks framed on the sheet
Charge: J4 J9 J11
Conn Puissance: J5-J8 J10 J31 J32
LEDs: D3 D5 D7 R17 R21 R24
CMD Traco: C11 C15 C19 D2 D4 D6 R20 R23 R26
Alimentation_12V: C8-C10 DC1 R18 R19
Alimentation_5P: C12-C14 DC2 R22
Alimentation_5L: C16-C18 DC3 R25

### Ports
5L, 5P, 12V, SW_AU (in), SW_L (in), VBATT

### Nets
5L: C17.1 C18.1 DC3.3(+Vout) J10.1 J11.1 J32.1 R24.1 ; port 5L
5P: C13.1 C14.1 DC2.3(+Vout) J8.1 J9.1 J31.1 R21.1 ; port 5P
12V: C9.1 C10.1 DC1.4(+Vout) J4.1 J5.2 J6.2 J7.2 R17.2 ; port 12V
GND: C8.2 C9.2 C10.2 C11.1 C12.2 C13.2 C14.2 C15.1 C16.2 C17.2 C18.2 C19.1 D3.1(C) D5.1(C) D7.1(C) DC1.2(-Vin) DC1.5(-Vout) DC2.2(-Vin_(GND)) DC2.5(-Vout) DC3.2(-Vin) DC3.5(-Vout) J4.2 J5.3 J6.3 J7.3 J8.2 J9.2 J10.2 J11.2 J31.2 J32.2 R19.2 R20.1 R22.2 R23.1 R25.2 R26.1
VBATT: C8.1 C12.1 C16.1 DC1.1(+Vin) DC2.1(+Vin_(Vcc)) DC3.1(+Vin) ; port VBATT
5L_EN: C19.2 D6.2 DC3.6(Remote) R26.2
5P_EN: C15.2 D4.2 DC2.6(Remote_On/Off) R23.2
12V_EN: C11.2 D2.2 DC1.3(Remote) R20.2
DNMXL_DATA: J5.1 J6.1 J7.1
SW_AU: D2.1 D4.1 ; port SW_AU
SW_L: D6.1 ; port SW_L
NetD3_2: D3.2(A) R17.1
NetD5_2: D5.2(A) R21.2
NetD7_2: D7.2(A) R24.2
NetDC1_6: DC1.6(Trim) R18.1
NetDC2_4: DC2.4(Trim) R22.1
NetDC3_4: DC3.4(Trim) R25.1
NetR18_2: R18.2 R19.1

### Layout directives
net class PWR_5A: 5P, 12V

### Notes on the sheet
- Traco
- charge resistive pour ne
- à peupler par des résistances
- pas laisser les traco à vide
- vers la carte Mère et le reste du robot
- commande propre des "remote" des traco
- 13.1V 4.58A
- traversante au besoin
- ou connecteur de sortie
- alternatif
- Multiprise Dynamixel
- (near J4) DNI
- 4.9mA
- (near DC1) open/high=ON, GND=OFF
- trim 5.4k => ~13.1V
- (near D3) "12V"
- prise: 691361100002
- conn alternatif.: 691321100002
- 6V 5A
- (near J9) DNI
- (+polarité)
- "5P"
- 2.8mA
- (near DC2) open/high=ON, GND=OFF
- trim 10k => ~6.06V
- (near D5) "5P"
- 5V 3A
- (near R25) DNI
- 1.8mA
- no trim
- (near J11) DNI
- "5L"
- (near D7) "5L"
- (near DC3) open/high=ON, GND=OFF
- Routing note
- Warning note
- Info note
- Function title
- Alim 2020

### Library data of the parts
C8 C12 C16 = WCAP-ATG8, 860010574011: as C2 on sheet Carte_Alim_TOP; ComponentLink1Description: Datasheet; ComponentLink1URL: http://katalog.we-online.de/pbs/datasheet/860010574011.pdf; Manufacturer Part Number: 860010574011; Value: 220 uF; Size: 8mmx11.5mm
C9 C10 C13 C14 C17 C18 = WCAP-ATG8, 860010374012: CAP Alu 470 UF 20% 16 V; Manufacturer: Wurth Elektronik; ComponentLink1Description: Datasheet; ComponentLink1URL: http://katalog.we-online.de/pbs/datasheet/860010374012.pdf; Manufacturer Part Number: 860010374012; Value: 470 uF; Size: 8mmx11.5mm
C11 C15 C19 = WCAP-CSGP, 885012206095: as C4 on sheet Carte_Alim_TOP; ComponentLink1Description: Datasheet; ComponentLink1URL: http://katalog.we-online.com/pbs/datasheet/885012206095.pdf; Value: 100nF; Size: 0603; CeramicType: X7R; Manufacturer Part Number: 885012206095; Supplier 2: JLCPCB; Supplier Part Number 2: C14663; Supplier Footprint 2: 0603
D2 D4 D6 = RBR3MM40ATFTR: DIODE SCHOTTKY 40V 3A SOD123-FL; Manufacturer: ROHM; Supplier 1: Farnell; Manufacturer Part Number: RBR3MM40ATFTR; ComponentLink1URL: http://www.farnell.com/datasheets/2067190.pdf; ComponentLink1Description: Datasheet; Supplier Part Number 1: 2581593; ComponentLink2Description: Manufacturer; ComponentLink2URL: http://www.rohm.com/web/global/products/-/product/RBR3MM40ATF; ContinuousForwardCurrent: 3A; Type: Schottky; Supplier 2: JLCPCB; Supplier Part Number 2: C8598; Value: 40V; Supplier Footprint 2: SOD-123
D3 D5 D7 = WL-SMCW 0603  150060RS75000: as D1 on sheet Carte_Alim_TOP; Manufacturer Part Number: 150060RS75000; ComponentLink1Description: Datasheet; ComponentLink1URL: http://katalog.we-online.com/led/datasheet/150060RS75000.pdf; Supplier 1: Farnell; Supplier Part Number 1: 2322071; Supplier 2: JLCPCB; Supplier Part Number 2: C2286; Supplier Footprint 2: LED_0603
DC1 = TEN 60-2412WIN: Traco 12.0V 60W 5A; Manufacturer: TRACOPOWER; Manufacturer Part Number: TEN 60-2412WIN; ComponentLink1URL: http://www.farnell.com/datasheets/2200542.pdf; ComponentLink1Description: Datasheet; Supplier 1: Farnell; Supplier Part Number 1: 2451635
DC2 = THN30-2411WI-A1: Traco 5V-6V 30W 6A; Manufacturer: TRACOPOWER; Manufacturer Part Number: THN30-2411WI-A1; ComponentLink1URL: https://www.tracopower.com/products/thn30wi.pdf; ComponentLink1Description: Datasheet; Supplier 1: Digikey; Supplier Part Number 1: 1951-3302-ND
DC3 = THN15-2411WI: Traco 5V 15W 3A; Manufacturer: TRACOPOWER; Manufacturer Part Number: THN15-2411WI; ComponentLink1URL: http://www.farnell.com/datasheets/1866342.pdf; ComponentLink1Description: Datasheet; Supplier 1: Farnell; Supplier Part Number 1: 1441226
J4 J9 J11 = 22-03-2021: as J36 on sheet Carte_Alim_TOP; Supplier 1: Farnell; Supplier Part Number 1: 9731075; Manufacturer Part Number: 22-03-2021; ComponentLink1URL: http://www.farnell.com/datasheets/1791308.pdf; ComponentLink1Description: Datasheet; ComponentLink2URL: http://www.farnell.com/cad/495071.pdf  http://www.farnell.com/cad/1533907.pdf  http://www.farnell.com/cad/1533907.pdf; ComponentLink2Description: Drawings
J5-J7 = 20-03-5035: CONN HEADER VERT 3POS 2.5MM; Manufacturer: MOLEX; Supplier 1: Farnell; Supplier Part Number 1: 9979620; Manufacturer Part Number: 22-03-5035; ComponentLink1URL: http://www.farnell.com/datasheets/1801024.pdf; ComponentLink1Description: Datasheet; ComponentLink2URL: http://www.farnell.com/cad/495071.pdf  http://www.farnell.com/cad/1533907.pdf  http://www.farnell.com/cad/1533907.pdf; ComponentLink2Description: Drawings
J8 J10 = 691322110002: WR-TBL 2p Series 3221 - 3.50 mm Horizontal PCB Header; Manufacturer: Wurth Electronics Inc.; Value: 2; Supplier 1: Farnell; Manufacturer Part Number: 691322110002; ComponentLink1URL: http://katalog.we-online.de/em/datasheet/6913221100xx.pdf; ComponentLink1Description: Datasheet; Supplier Part Number 1: 1841315
J31 J32 = 691321100002: WR-TBL 2p Series 3211 - 3.50 mm Vertical PCB Header; Manufacturer: Wurth Electronics Inc.; Value: 2; Supplier 1: Farnell; Manufacturer Part Number: 691321100002; Supplier Part Number 1: 1841308; ComponentLink1Description: Datasheet; ComponentLink1URL: https://katalog.we-online.de/em/datasheet/6913211000xx.pdf
R17 = RC0603FR-071K8L: RES SMD 1.8K OHM 1% 1/10W 0603; Manufacturer: Yageo; Power: 100mW; Vmax: 50V; Manufacturer Part Number: RC0603FR-071K8L; Type: Thick Film; ComponentLink1Description: Manufacturer; ComponentLink1URL: http://www.yageo.com/NewPortal/_en/index.jsp; ComponentLink2Description: Datasheet; ComponentLink2URL: http://www.farnell.com/datasheets/2167052.pdf; Precision: ±1%; Supplier 1: Farnell; Supplier Part Number 1: 9238514; Supplier 2: JLCPCB; Supplier Part Number 2: C4177; Supplier Footprint 2: 0603
R18 R19 = RC0805FR-072K7L: as R6 on sheet Carte_Alim_TOP; Manufacturer Part Number: RC0805FR-072K7L; Type: Thick Film; ComponentLink1Description: Manufacturer; ComponentLink1URL: http://www.yageo.com/NewPortal/_en/index.jsp; ComponentLink2Description: Datasheet; ComponentLink2URL: http://www.farnell.com/datasheets/444164.pdf; Supplier 1: Farnell; Supplier Part Number 1: 9237666; Precision: ±1%; Supplier 2: JLCPCB; Supplier Part Number 2: C17530; Supplier Footprint 2: 0805
R20 R22 R23 R25 R26 = RC0603FR-0710KL: as R1 on sheet Carte_Alim_TOP; Manufacturer Part Number: RC0603FR-0710KL; Type: Thick Film; ComponentLink1Description: Manufacturer; ComponentLink1URL: http://www.yageo.com/NewPortal/_en/index.jsp; ComponentLink2Description: Datasheet; ComponentLink2URL: http://www.farnell.com/datasheets/2167052.pdf; Supplier 1: Farnell; Supplier Part Number 1: 9238603; Precision: ±1%; Supplier 2: JLCPCB; Supplier Part Number 2: C25804; Supplier Footprint 2: 0603
R21 R24 = RC0603FR-071KL: as R9 on sheet Carte_Alim_TOP; Manufacturer Part Number: RC0603FR-071KL; Type: Thick Film; ComponentLink1Description: Manufacturer; ComponentLink1URL: http://www.yageo.com/NewPortal/_en/index.jsp; ComponentLink2Description: Datasheet; ComponentLink2URL: http://www.farnell.com/datasheets/2167052.pdf; Precision: ±1%; Supplier 1: Farnell; Supplier Part Number 1: 9238484; Supplier 2: JLCPCB; Supplier Part Number 2: C21190; Supplier Footprint 2: 0603

## Sheet Carte_Alim_MOT.SchDoc
size A4; Author: Audran; CompanyName: Goldorak; Address1: Electrolab; Address2: 52 rue Paul Lescop; Address3: 92000 Nanterre; DocumentNumber: 3; SheetNumber: 3; SheetTotal: 5; ProjectName: Cartes_2017
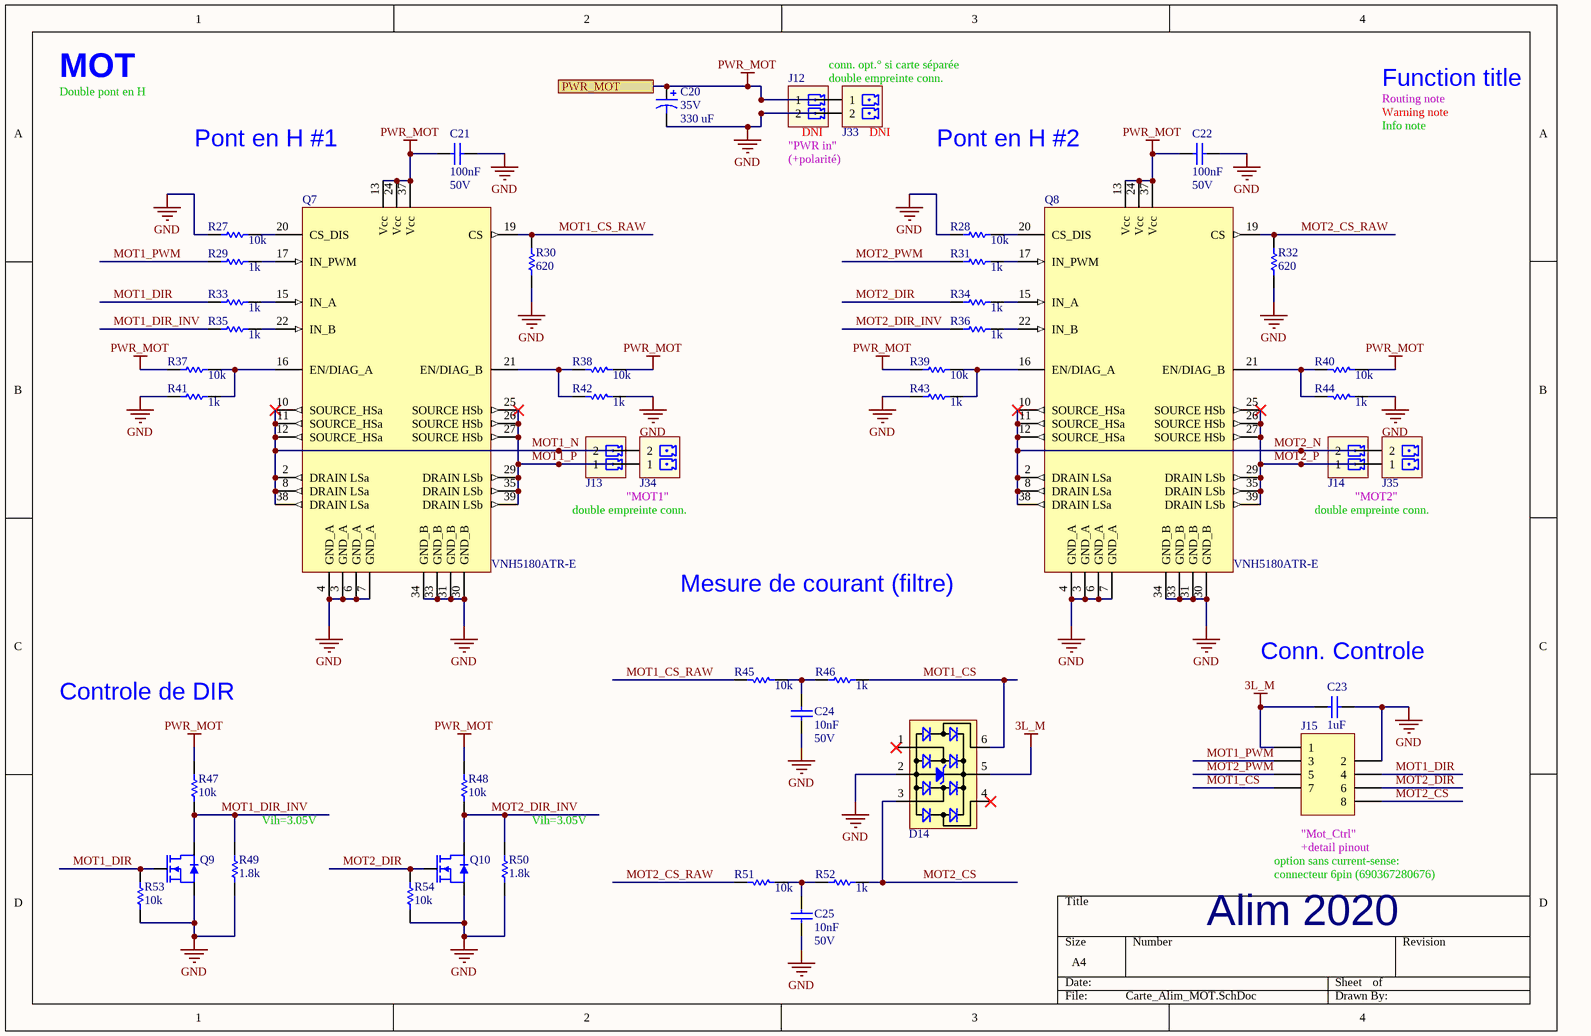
[diagram p3: Carte_Alim_MOT.SchDoc]

### Parts
C20  330 uF  RatedVoltage: 35V  [WCAP-ATG8_10x12.5x5x0.6]
C21  100nF  RatedVoltage: 50V  [WCAP-CSGP_0603, 1.6x0.8x0.8]
C22  100nF  RatedVoltage: 50V  [WCAP-CSGP_0603, 1.6x0.8x0.8]
C23  1uF  [WCAP-CSGP_0805, 2x1.25x1.25]
C24  10nF  RatedVoltage: 50V  [WCAP-CSGP_0402, 1x0.5x0.5]
C25  10nF  RatedVoltage: 50V  [WCAP-CSGP_0402, 1x0.5x0.5]
D14  824001  [SOT-23-6L]  (value not drawn)
J12  691322110002  [691322110002]  (value not drawn)
J13  691322110002  [691322110002]  (value not drawn)
J14  691322110002  [691322110002]  (value not drawn)
J15  690367280876  [690367280876]  (value not drawn)
J33  691321100002  [691321100002]  (value not drawn)
J34  691321100002  [691321100002]  (value not drawn)
J35  691321100002  [691321100002]  (value not drawn)
Q7  VNH5180ATR-E  [SSOP50P1030X247-36N]
Q8  VNH5180ATR-E  [SSOP50P1030X247-36N]
Q9  2N7002  [SOT-23]  (value not drawn)
Q10  2N7002  [SOT-23]  (value not drawn)
R27  value 10k  [RESC1608X06N]  (hidden comment: RC0603FR-0710KL)
R28  value 10k  [RESC1608X06N]  (hidden comment: RC0603FR-0710KL)
R29  value 1k  [RESC1608X06N]  (hidden comment: RC0603FR-071KL)
R30  value 620  [RESC1608X06N]  (hidden comment: RC0603FR-07620RL)
R31  value 1k  [RESC1608X06N]  (hidden comment: RC0603FR-071KL)
R32  value 620  [RESC1608X06N]  (hidden comment: RC0603FR-07620RL)
R33  value 1k  [RESC1608X06N]  (hidden comment: RC0603FR-071KL)
R34  value 1k  [RESC1608X06N]  (hidden comment: RC0603FR-071KL)
R35  value 1k  [RESC1608X06N]  (hidden comment: RC0603FR-071KL)
R36  value 1k  [RESC1608X06N]  (hidden comment: RC0603FR-071KL)
R37  value 10k  [RESC1608X06N]  (hidden comment: RC0603FR-0710KL)
R38  value 10k  [RESC1608X06N]  (hidden comment: RC0603FR-0710KL)
R39  value 10k  [RESC1608X06N]  (hidden comment: RC0603FR-0710KL)
R40  value 10k  [RESC1608X06N]  (hidden comment: RC0603FR-0710KL)
R41  value 1k  [RESC1608X06N]  (hidden comment: RC0603FR-071KL)
R42  value 1k  [RESC1608X06N]  (hidden comment: RC0603FR-071KL)
R43  value 1k  [RESC1608X06N]  (hidden comment: RC0603FR-071KL)
R44  value 1k  [RESC1608X06N]  (hidden comment: RC0603FR-071KL)
R45  value 10k  [RESC1608X06N]  (hidden comment: RC0603FR-0710KL)
R46  value 1k  [RESC1608X06N]  (hidden comment: RC0603FR-071KL)
R47  value 10k  [RESC1608X06N]  (hidden comment: RC0603FR-0710KL)
R48  value 10k  [RESC1608X06N]  (hidden comment: RC0603FR-0710KL)
R49  value 1.8k  [RESC1608X06N]  (hidden comment: RC0603FR-071K8L)
R50  value 1.8k  [RESC1608X06N]  (hidden comment: RC0603FR-071K8L)
R51  value 10k  [RESC1608X06N]  (hidden comment: RC0603FR-0710KL)
R52  value 1k  [RESC1608X06N]  (hidden comment: RC0603FR-071KL)
R53  value 10k  [RESC1608X06N]  (hidden comment: RC0603FR-0710KL)
R54  value 10k  [RESC1608X06N]  (hidden comment: RC0603FR-0710KL)

### Ports
PWR_MOT

### Nets
3L_M: C23.2 D14.5 J15.1
GND: C20.2 C21.1 C22.1 C23.1 C24.1 C25.1 D14.2 J12.2 J15.2 J33.2 Q7.3(GND_A) Q7.4(GND_A) Q7.6(GND_A) Q7.7(GND_A) Q7.30(GND_B) Q7.31(GND_B) Q7.33(GND_B) Q7.34(GND_B) Q8.3(GND_A) Q8.4(GND_A) Q8.6(GND_A) Q8.7(GND_A) Q8.30(GND_B) Q8.31(GND_B) Q8.33(GND_B) Q8.34(GND_B) Q9.2(S) Q10.2(S) R27.1 R28.1 R30.1 R32.1 R41.1 R42.1 R43.1 R44.1 R49.1 R50.1 R53.1 R54.1
PWR_MOT: C20.1 C21.2 C22.2 J12.1 J33.1 Q7.13(Vcc) Q7.24(Vcc) Q7.37(Vcc) Q8.13(Vcc) Q8.24(Vcc) Q8.37(Vcc) R37.2 R38.2 R39.2 R40.2 R47.2 R48.2 ; port PWR_MOT  [project net PWR]
MOT1_CS: D14.6 J15.7 R46.2
MOT1_CS_RAW: Q7.19(CS) R30.2 R45.1
MOT1_DIR: J15.4 Q9.1(G) R33.1 R53.2
MOT1_DIR_INV: Q9.3(D) R35.1 R47.1 R49.2
MOT1_N: J13.2 J34.2 Q7.2(DRAIN_LSa) Q7.8(DRAIN_LSa) Q7.10(SOURCE_HSa) Q7.11(SOURCE_HSa) Q7.12(SOURCE_HSa) Q7.38(DRAIN_LSa)
MOT1_P: J13.1 J34.1 Q7.25(SOURCE_HSb) Q7.26(SOURCE_HSb) Q7.27(SOURCE_HSb) Q7.29(DRAIN_LSb) Q7.35(DRAIN_LSb) Q7.39(DRAIN_LSb)
MOT1_PWM: J15.3 R29.1
MOT2_CS: D14.3 J15.8 R52.2
MOT2_CS_RAW: Q8.19(CS) R32.2 R51.1
MOT2_DIR: J15.6 Q10.1(G) R34.1 R54.2
MOT2_DIR_INV: Q10.3(D) R36.1 R48.1 R50.2
MOT2_N: J14.2 J35.2 Q8.2(DRAIN_LSa) Q8.8(DRAIN_LSa) Q8.10(SOURCE_HSa) Q8.11(SOURCE_HSa) Q8.12(SOURCE_HSa) Q8.38(DRAIN_LSa)
MOT2_P: J14.1 J35.1 Q8.25(SOURCE_HSb) Q8.26(SOURCE_HSb) Q8.27(SOURCE_HSb) Q8.29(DRAIN_LSb) Q8.35(DRAIN_LSb) Q8.39(DRAIN_LSb)
MOT2_PWM: J15.5 R31.1
NetC24_2: C24.2 R45.2 R46.1
NetC25_2: C25.2 R51.2 R52.1
NetQ7_15: Q7.15(IN_A) R33.2
NetQ7_16: Q7.16(EN/DIAG_A) R37.1 R41.2
NetQ7_17: Q7.17(IN_PWM) R29.2
NetQ7_20: Q7.20(CS_DIS) R27.2
NetQ7_21: Q7.21(EN/DIAG_B) R38.1 R42.2
NetQ7_22: Q7.22(IN_B) R35.2
NetQ8_15: Q8.15(IN_A) R34.2
NetQ8_16: Q8.16(EN/DIAG_A) R39.1 R43.2
NetQ8_17: Q8.17(IN_PWM) R31.2
NetQ8_20: Q8.20(CS_DIS) R28.2
NetQ8_21: Q8.21(EN/DIAG_B) R40.1 R44.2
NetQ8_22: Q8.22(IN_B) R36.2

Not connected (* = marked no-connect by the designer): D14 1* 4*; Q7 1(nc) 5(nc) 9(nc) 14(nc) 18(nc) 23(nc) 28(nc) 32(nc) 36(nc); Q8 1(nc) 5(nc) 9(nc) 14(nc) 18(nc) 23(nc) 28(nc) 32(nc) 36(nc)

### Notes on the sheet
- MOT
- Double pont en H
- (near J33) conn. opt.° si carte séparée
- (near J33) double empreinte conn.
- Routing note
- Warning note
- Function title
- Pont en H #1
- "PWR in"
- (+polarité)
- DNI
- (near J33) DNI
- Pont en H #2
- Info note
- double empreinte conn.
- (near J34) "MOT1"
- "MOT2"
- (near Q8) Mesure de courant (filtre)
- Controle de DIR
- (near C23) Conn. Controle
- (near R49) Vih=3.05V
- (near R50) Vih=3.05V
- (near J15) "Mot_Ctrl"
- (near J15) +detail pinout
- option sans current-sense:
- connecteur 6pin (690367280676)
- Alim 2020

### Library data of the parts
C20 = WCAP-ATG8, 860010575012: as C6 on sheet Carte_Alim_TOP; ComponentLink1Description: Datasheet; ComponentLink1URL: http://katalog.we-online.de/pbs/datasheet/860010575012.pdf; Manufacturer Part Number: 860010575012; Value: 330 uF; Size: 10mmx12.5mm
C21 C22 = WCAP-CSGP, 885012206095: as C4 on sheet Carte_Alim_TOP; ComponentLink1Description: Datasheet; ComponentLink1URL: http://katalog.we-online.com/pbs/datasheet/885012206095.pdf; Value: 100nF; Size: 0603; CeramicType: X7R; Manufacturer Part Number: 885012206095; Supplier 2: JLCPCB; Supplier Part Number 2: C14663; Supplier Footprint 2: 0603
C23 = WCAP-CSGP, 885012207103: as C1 on sheet Carte_Alim_TOP; ComponentLink1Description: Datasheet; ComponentLink1URL: http://katalog.we-online.com/pbs/datasheet/885012207103.pdf; Manufacturer Part Number: 885012207103; Value: 1uF; Size: 0805; CeramicType: X7R; RatedVoltage: 50V; Supplier 2: JLCPCB; Supplier Part Number 2: C28323; Supplier Footprint 2: 0805
C24 C25 = WCAP-CSGP, 885012205067: CAP CER 10nF 50V X7R 0402; Manufacturer: Wurth Elektronik; ComponentLink1Description: Datasheet; ComponentLink1URL: http://katalog.we-online.com/pbs/datasheet/885012205067.pdf; Manufacturer Part Number: 885012205067; Value: 10nF; Size: 0402; CeramicType: X7R; Supplier 2: JLCPCB; Supplier Part Number 2: C15195; Supplier Footprint 2: 0402
D14 = 824001: WE-TVS TVS Diode 4+1Ch 5V SOT23-6L; Manufacturer: Wurth Elektronik; ComponentLink1Description: Datasheet; ComponentLink1URL: https://www.we-online.com/catalog/datasheet/824001.pdf; Manufacturer Part Number: 824001; Supplier 1: Farnell; Supplier Part Number 1: 1748613; Type: TVS; Value: 5V; Supplier 2: JLCPCB; Supplier Part Number 2: C85364; Supplier Footprint 2: SOT-23-6L
J12-J14 = 691322110002: as J8 on sheet Carte_Alim_TRACO; Supplier 1: Farnell; Manufacturer Part Number: 691322110002; ComponentLink1URL: http://katalog.we-online.de/em/datasheet/6913221100xx.pdf; ComponentLink1Description: Datasheet; Supplier Part Number 1: 1841315
J15 = 690367280876: as J16 on sheet Carte_Alim_CAP; Manufacturer Part Number: 690367280876; ComponentLink1Description: Datasheet; ComponentLink1URL: http://katalog.we-online.de/em/datasheet/69036728xx76.pdf; Supplier 1: Farnell; Supplier Part Number 1: 1641850
J33-J35 = 691321100002: as J31 on sheet Carte_Alim_TRACO; Supplier 1: Farnell; Manufacturer Part Number: 691321100002; Supplier Part Number 1: 1841308; ComponentLink1Description: Datasheet; ComponentLink1URL: https://katalog.we-online.de/em/datasheet/6913211000xx.pdf
Q7 Q8 = VNH5180ATR-E: IC MOTOR DRIVER PAR 36POWERSSO; Manufacturer: STMicroelectronics; Manufacturer Part Number: VNH5180ATR-E; ComponentLink1URL: http://www.st.com/content/ccc/resource/technical/document/datasheet/ce/72/6c/f3/65/47/45/b3/CD00264619.pdf/files/CD00264619.pdf/jcr:content/translations/en.CD00264619.pdf; ComponentLink1Description: Datasheet; Supplier 1: Farnell; Supplier Part Number 1: 2849833
Q9 Q10 = 2N7002: as Q2 on sheet Carte_Alim_TOP; Supplier 1: Farnell; Supplier Part Number 1: 1510761; Manufacturer Part Number: 2N7002; ComponentLink1Description: Datasheet; ComponentLink1URL: https://datasheet.lcsc.com/szlcsc/1810151612_Changjiang-Electronics-Tech-CJ-2N7002_C8545.pdf; Supplier 2: JLCPCB; Supplier Part Number 2: C8545; Supplier Footprint 2: SOT-23-3
R27 R28 R37-R40 R45 R47 R48 R51 R53 R54 = RC0603FR-0710KL: as R1 on sheet Carte_Alim_TOP; Type: Thick Film; ComponentLink1Description: Manufacturer; ComponentLink1URL: http://www.yageo.com/NewPortal/_en/index.jsp; ComponentLink2Description: Datasheet; ComponentLink2URL: http://www.farnell.com/datasheets/2167052.pdf; Supplier 1: Farnell; Supplier Part Number 1: 9238603; Manufacturer Part Number: RC0603FR-0710KL; Precision: ±1%; Supplier 2: JLCPCB; Supplier Part Number 2: C25804; Supplier Footprint 2: 0603
R29 R31 R33-R36 R41-R44 R46 R52 = RC0603FR-071KL: as R9 on sheet Carte_Alim_TOP; Type: Thick Film; ComponentLink1Description: Manufacturer; ComponentLink1URL: http://www.yageo.com/NewPortal/_en/index.jsp; ComponentLink2Description: Datasheet; ComponentLink2URL: http://www.farnell.com/datasheets/2167052.pdf; Manufacturer Part Number: RC0603FR-071KL; Supplier 1: Farnell; Supplier Part Number 1: 9238484; Precision: ±1%; Supplier 2: JLCPCB; Supplier Part Number 2: C21190; Supplier Footprint 2: 0603
R30 R32 = RC0603FR-07620RL: RES SMD 620 OHM 1% 1/10W 0603; Manufacturer: Yageo; Power: 100mW; Vmax: 50V; Type: Thick Film; ComponentLink1Description: Manufacturer; ComponentLink1URL: http://www.yageo.com/NewPortal/_en/index.jsp; ComponentLink2Description: Datasheet; ComponentLink2URL: http://www.farnell.com/datasheets/1868787.pdf; Manufacturer Part Number: RC0603FR-07620RL; Precision: ±1%; Supplier 1: Digi-Key; Supplier Part Number 1: 311-620HRCT-ND; Supplier 2: JLCPCB; Supplier Part Number 2: C23220; Supplier Footprint 2: 0603
R49 R50 = RC0603FR-071K8L: as R17 on sheet Carte_Alim_TRACO; Manufacturer Part Number: RC0603FR-071K8L; Type: Thick Film; ComponentLink1Description: Manufacturer; ComponentLink1URL: http://www.yageo.com/NewPortal/_en/index.jsp; ComponentLink2Description: Datasheet; ComponentLink2URL: http://www.farnell.com/datasheets/2167052.pdf; Precision: ±1%; Supplier 1: Farnell; Supplier Part Number 1: 9238514; Supplier 2: JLCPCB; Supplier Part Number 2: C4177; Supplier Footprint 2: 0603